# Altium schematic sheet 2_PWR.SchDoc: SmartHalo V1.0 Rev1 - Power Supply
size B; Author: Sébastien Gélinas; Organization: CycleLabs Solutions Inc.; Address1: 5445 de Gaspé; Address2: Montréal, QC; Address3: Canada; Address4: H2T 3B2; DocumentNumber: 1; Revision: 1; SheetNumber: 2; SheetTotal: 8
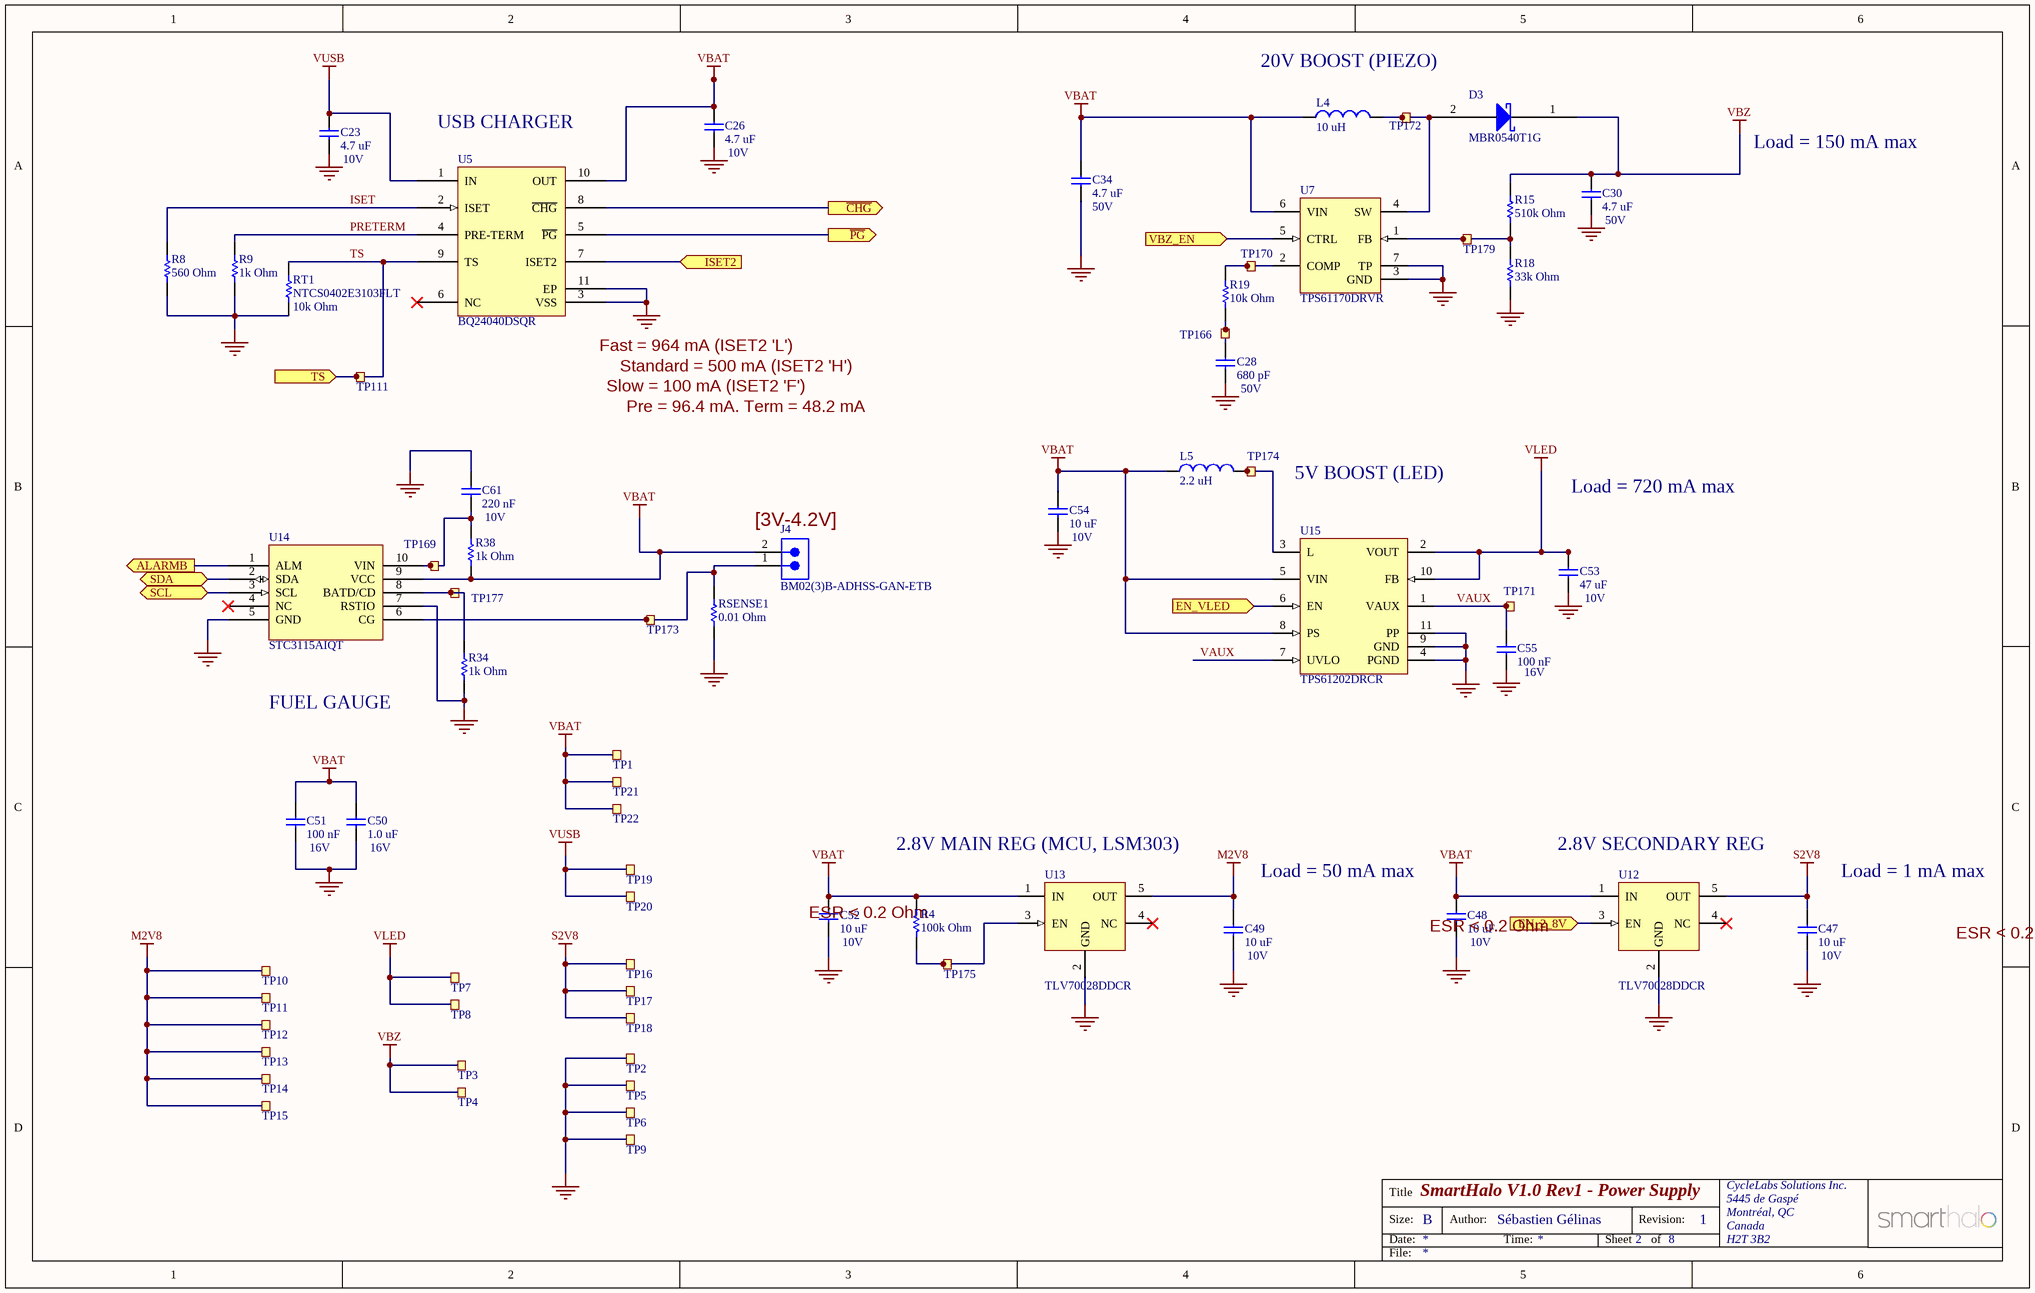
[diagram p0: 2_PWR.SchDoc]

## Parts
C23  4.7 uF  Voltage Rating: 10V  [Varitron_CAP0603]
C26  4.7 uF  Voltage Rating: 10V  [Varitron_CAP0603]
C28  680 pF  Voltage Rating: 50V  [Varitron_CAP0402]
C30  4.7 uF  Voltage Rating: 50V  [Varitron_CAP0805]
C34  4.7 uF  Voltage Rating: 50V  [Varitron_CAP0805]
C47  10 uF  Voltage Rating: 10V  [Varitron_CAP0805]
C48  10 uF  Voltage Rating: 10V  [Varitron_CAP0805]
C49  10 uF  Voltage Rating: 10V  [Varitron_CAP0805]
C50  1.0 uF  Voltage Rating: 16V  [Varitron_CAP0603]
C51  100 nF  Voltage Rating: 16V  [Varitron_CAP0402]
C52  10 uF  Voltage Rating: 10V  [Varitron_CAP0805]
C53  47 uF  Voltage Rating: 10V  [Varitron_CAP1206]
C54  10 uF  Voltage Rating: 10V  [Varitron_CAP0805]
C55  100 nF  Voltage Rating: 16V  [Varitron_CAP0402]
C61  220 nF  Voltage Rating: 10V  [Varitron_CAP0402]
D3  MBR0540T1G  [ONSC-SOD-123-2-425-04_V]
J4  BM02(3)B-ADHSS-GAN-ETB  [BM02(3)B-ADHSS-GAN-ETB]
L4  10 uH  [SRN5020-100M]
L5  2.2 uH  [SRN3015-2R2M]
R4  100k Ohm  [Varitron_RES0402]
R8  560 Ohm  [Varitron_RES0402]
R9  1k Ohm  [Varitron_RES0402]
R15  510k Ohm  [Varitron_RES0402]
R18  33k Ohm  [Varitron_RES0402]
R19  10k Ohm  [Varitron_RES0402]
R34  1k Ohm  [Varitron_RES0402]
R38  1k Ohm  [Varitron_RES0402]
RSENSE1  0.01 Ohm  [Varitron_RES0805]
RT1  NTCS0402E3103FLT  value 10k Ohm  [Varitron_RES0402]
TP1  TP1  [TESTPAD-TH-35mils]  (value not drawn)  (no BOM)
TP2  TP2  [TESTPAD-TH-1_5mm]  (value not drawn)  (no BOM)
TP3  TP3  [TESTPAD-TH-1_5mm]  (value not drawn)  (no BOM)
TP4  TP4  [TESTPAD-TH-35mils]  (value not drawn)  (no BOM)
TP5  TP5  [TESTPAD-TH-1_5mm]  (value not drawn)  (no BOM)
TP6  TP6  [TESTPAD-TH-1_5mm]  (value not drawn)  (no BOM)
TP7  TP7  [TESTPAD-TH-1_5mm]  (value not drawn)  (no BOM)
TP8  TP8  [TESTPAD-TH-1_5mm]  (value not drawn)  (no BOM)
TP9  TP9  [TESTPAD-TH-1_5mm]  (value not drawn)  (no BOM)
TP10  TP10  [TESTPAD-TH-1_5mm]  (value not drawn)  (no BOM)
TP11  TP11  [TESTPAD-TH-1_5mm]  (value not drawn)  (no BOM)
TP12  TP12  [TESTPAD-TH-35mils]  (value not drawn)  (no BOM)
TP13  TP13  [TESTPAD-TH-35mils]  (value not drawn)  (no BOM)
TP14  TP14  [TESTPAD-TH-35mils]  (value not drawn)  (no BOM)
TP15  TP15  [TESTPAD-TH-35mils]  (value not drawn)  (no BOM)
TP16  TP16  [TESTPAD-TH-1_5mm]  (value not drawn)  (no BOM)
TP17  TP17  [TESTPAD-TH-35mils]  (value not drawn)  (no BOM)
TP18  TP18  [TESTPAD-TH-1_5mm]  (value not drawn)  (no BOM)
TP19  TP19  [TESTPAD-TH-1_5mm]  (value not drawn)  (no BOM)
TP20  TP20  [TESTPAD-TH-35mils]  (value not drawn)  (no BOM)
TP21  TP21  [TESTPAD-TH-1_5mm]  (value not drawn)  (no BOM)
TP22  TP22  [TESTPAD-TH-35mils]  (value not drawn)  (no BOM)
TP111  TP111  [TESTPAD-TH-35mils]  (value not drawn)  (no BOM)
TP166  TP166  [TESTPAD-TH-35mils]  (value not drawn)  (no BOM)
TP169  TP169  [TESTPAD-TH-35mils]  (value not drawn)  (no BOM)
TP170  TP170  [TESTPAD-TH-35mils]  (value not drawn)  (no BOM)
TP171  TP171  [TESTPAD-TH-35mils]  (value not drawn)  (no BOM)
TP172  TP172  [TESTPAD-TH-35mils]  (value not drawn)  (no BOM)
TP173  TP173  [TESTPAD-TH-35mils]  (value not drawn)  (no BOM)
TP174  TP174  [TESTPAD-TH-35mils]  (value not drawn)  (no BOM)
TP175  TP175  [TESTPAD-TH-35mils]  (value not drawn)  (no BOM)
TP177  TP177  [TESTPAD-TH-35mils]  (value not drawn)  (no BOM)
TP179  TP179  [TESTPAD-TH-35mils]  (value not drawn)  (no BOM)
U5  BQ24040DSQR  [DSQ10-1500X900TP]
U7  TPS61170DRVR  [DRV6-1600X1000TP]
U12  TLV70028DDCR  [SOT23-5_N]
U13  TLV70028DDCR  [SOT23-5_N]
U14  STC3115AIQT  [DFN10]
U15  TPS61202DRCR  [DRC10-2400X1650TP]

## Ports
ALARMB (out), EN_2_8V (in), EN_VLED (in), ISET2 (in), SCL (bidir), SDA (bidir), TS (in), VBZ_EN (in), ~{CHG} (out), ~{PG} (out)

## Nets
GND: C23.2 C26.2 C28.2 C30.2 C34.2 C47.2 C48.2 C49.2 C50.2 C51.2 C52.2 C53.2 C54.2 C55.2 C61.2 J4.0(ASSY) R8.2 R9.2 R18.1 R34.1 RSENSE1.1 RT1.1 TP2.1 TP5.1 TP6.1 TP9.1 U5.3(VSS) U5.11(EP) U7.3(GND) U7.7(TP) U12.2(GND) U13.2(GND) U14.5(GND) U14.7(RSTIO) U15.4(PGND) U15.9(GND) U15.11(PP)
M2V8: C49.1 TP10.1 TP11.1 TP12.1 TP13.1 TP14.1 TP15.1 U13.5(OUT)
S2V8: C47.1 TP16.1 TP17.1 TP18.1 U12.5(OUT)
VBAT: C26.1 C34.1 C48.1 C50.1 C51.1 C52.1 C54.1 J4.2 L4.1 L5.1 R4.2 R38.1 TP1.1 TP21.1 TP22.1 U5.10(OUT) U7.6(VIN) U12.1(IN) U13.1(IN) U14.9(VCC) U15.5(VIN) U15.8(PS)
VBZ: C30.1 D3.1(Cathode) R15.2 TP3.1 TP4.1
VLED: C53.1 TP7.1 TP8.1 U15.2(VOUT) U15.10(FB)
VUSB: C23.1 TP19.1 TP20.1 U5.1(IN)
ALARMB: U14.1(ALM) ; port ALARMB
~{CHG}: U5.8(~{CHG}) ; port ~{CHG}
EN_2_8V: U12.3(EN) ; port EN_2_8V
EN_VLED: U15.6(EN) ; port EN_VLED
ISET: R8.1 U5.2(ISET)
ISET2: U5.7(ISET2) ; port ISET2
~{PG}: U5.5(~{PG}) ; port ~{PG}
PRETERM: R9.1 U5.4(PRE-TERM)
SCL: U14.3(SCL) ; port SCL
SDA: U14.2(SDA) ; port SDA
TS: RT1.2 TP111.1 U5.9(TS) ; port TS
VAUX: C55.1 TP171.1 U15.1(VAUX) U15.7(UVLO)
VBZ_EN: U7.5(CTRL) ; port VBZ_EN
NetC28_1: C28.1 R19.2 TP166.1
NetC61_1: C61.1 R38.2 TP169.1 U14.10(VIN)
NetD3_2: D3.2(Anode) L4.2 TP172.1 U7.4(SW)
NetJ4_1: J4.1 RSENSE1.2 TP173.1 U14.6(CG)
NetL5_2: L5.2 TP174.1 U15.3(L)
NetR4_1: R4.1 TP175.1 U13.3(EN)
NetR15_1: R15.1 R18.2 TP179.1 U7.1(FB)
NetR19_1: R19.1 TP170.1 U7.2(COMP)
NetR34_2: R34.2 TP177.1 U14.8(BATD/CD)

Not connected (* = marked no-connect by the designer): U5 6(NC)*; U12 4(NC)*; U13 4(NC)*; U14 4(NC)*

## Notes on the sheet
- 20V BOOST (PIEZO)
- (near U5) USB CHARGER
- Load = 150 mA max
- Fast = 964 mA (ISET2 'L')
- (near TP111) Standard = 500 mA (ISET2 'H')
- (near TP111) Slow = 100 mA (ISET2 'F')
- (near TP111) Pre = 96.4 mA. Term = 48.2 mA
- 5V BOOST (LED)
- Load = 720 mA max
- (near J4) [3V-4.2V]
- FUEL GAUGE
- 2.8V MAIN REG (MCU, LSM303)
- Load = 50 mA max
- (near U12) 2.8V SECONDARY REG
- Load = 1 mA max
- (near C52) ESR < 0.2 Ohm
- (near C48) ESR < 0.2 Ohm
- (near C47) ESR < 0.2 Ohm
- Title
- Size:
- Date:
- B
- Author:
- Time:
- Sheet
- Revision:
- of
- File:

## Library data of the parts
C23 C26 = Varitron_CAP0603: 4.7 uF 10V X5R 10% 0603 (1608 Metric)  SMD; Manufacturer: Yageo; Manufacturer Part Number: CC0603KRX5R6BB475; SmartHalo Part Number: 630009-01; Case-EIA: 0603; Case-Metric: 1608; Final: Y; Tolerance: 10%; Technology: SMT; Temperature Coefficient: X5R; Part Number: CC0603KRX5R6BB475; Value: 4.7 uF; Supplier: Arrow Electronics; Footprint Name: 0603
C28 = Varitron_CAP0402: 680 pF 50V X7R 5% 0402 (1005 Metric)  SMD; Manufacturer: Yageo; Manufacturer Part Number: CC0402JRX7R9BB681; SmartHalo Part Number: 630011-01; Case-EIA: 0402; Case-Metric: 1005; Final: Y; Tolerance: 5%; Technology: SMT; Temperature Coefficient: X7R; Part Number: CC0402JRX7R9BB681; Value: 680 pF; Supplier: Arrow Electronics; Footprint Name: 0402
C30 C34 = Varitron_CAP0805: 4.7 uF 50V X5R 10% 0805 (2012 Metric)  SMD; Manufacturer: Samsung; Manufacturer Part Number: CL21A475KBQNNNE; SmartHalo Part Number: 630010-01; Case-EIA: 0805; Case-Metric: 2012; Final: Y; Tolerance: 10%; Technology: SMT; Temperature Coefficient: X5R; Part Number: CL21A475KBQNNNE; Value: 4.7 uF; Supplier: Arrow Electronics; Footprint Name: 0805
C47-C49 C52 C54 = Varitron_CAP0805: 10 uF 10V X7R 10% 0805 (2012 Metric)  SMD; Manufacturer: Samsung; Manufacturer Part Number: CL21B106KPQNNNE; SmartHalo Part Number: 630013-01; Case-EIA: 0805; Case-Metric: 2012; Final: Y; Tolerance: 10%; Technology: SMT; Temperature Coefficient: X7R; Part Number: CL21B106KPQNNNE; Value: 10 uF; Supplier: Arrow Electronics; Footprint Name: 0805
C50 = Varitron_CAP0603: 1.0 uF 16V X7R 10% 0603 (1608 Metric)  SMD; Manufacturer: Samsung; Manufacturer Part Number: CL10B105KO8NNNC; SmartHalo Part Number: 630002-01; Case-EIA: 0603; Case-Metric: 1608; Final: Y; Tolerance: 10%; Technology: SMT; Temperature Coefficient: X7R; Part Number: CL10B105KO8NNNC; Value: 1.0 uF; Supplier: Arrow Electronics; Footprint Name: 0603
C51 C55 = Varitron_CAP0402: 100 nF 16V X7R 10% 0402 (1005 Metric)  SMD; Manufacturer: Samsung; Manufacturer Part Number: CL05B104KO5NNNC; SmartHalo Part Number: 630003-01; Case-EIA: 0402; Case-Metric: 1005; Final: Y; Tolerance: 10%; Technology: SMT; Temperature Coefficient: X7R; Part Number: CL05B104KO5NNNC; Value: 100 nF; Supplier: Arrow Electronics; Footprint Name: 0402
C53 = Varitron_CAP1206: 47 uF 10V X5R 10% 1206 (3216 Metric)  SMD; Manufacturer: Murata; Manufacturer Part Number: GRM31CR61A476KE15L; SmartHalo Part Number: 630015-01; Case-EIA: 1206; Case-Metric: 3216; Final: Y; Tolerance: 10%; Technology: SMT; Temperature Coefficient: X5R; Part Number: GRM31CR61A476KE15L; Value: 47 uF; Supplier: Arrow Electronics; Footprint Name: 1206
C61 = Varitron_CAP0402: 220 nF 10V X7R 10% 0402 (1005 Metric)  SMD; Manufacturer: Samsung; Manufacturer Part Number: CL05B224KP5NNNC; SmartHalo Part Number: 630014-01; Case-EIA: 0402; Case-Metric: 1005; Final: Y; Tolerance: 10%; Technology: SMT; Temperature Coefficient: X7R; Part Number: CL05B224KP5NNNC; Value: 220 nF; Supplier: Arrow Electronics; Footprint Name: 0402
D3 = MBR0540T1G: Schottky Power Rectifier, 2-Pin SOD-123, Pb-Free, Tape and Reel; Manufacturer: ON Semiconductor; SmartHalo Part Number: 630017-01; Final: Y; Manufacturer Part Number: MBR0540T1G; Part Number: MBR0540T1G; Footprint Name: SOD123; Supplier: Arrow Electronics
J4 = BM02(3)B-ADHSS-GAN-ETB: Connector, 1.3 mm pitch; Manufacturer: JST; SmartHalo Part Number: 630021-01; Final: Y; Manufacturer Part Number: BM02(3)B-ADHSS-GAN-ETB; Part Number: BM02(3)B-ADHSS-GAN-ETB; Footprint Name: CUSTOM(ADH Connector 2 pins); Supplier: Arrow Electronics
L4 = SRN5020-100M: Inductor, 10 uH, 20%, 144 mOhm DCR, 1.3A; Manufacturer: Bourns; SmartHalo Part Number: 630027-01; Final: Y; Manufacturer Part Number: SRN5020-100M; Part Number: SRN5020-100M; Value: 10 uH; Tolerance: 20%; DCR: 144 mOhm; Saturation Current: 1.3A; Footprint Name: IND5020; Supplier: Arrow Electronics
L5 = SRN3015-2R2M: Inductor, 2.2 uH, 20%, 72 mOhm DCR, 1.65A; Manufacturer: Bourns; SmartHalo Part Number: 630028-01; DCR: 72 mOhm; Final: Y; Manufacturer Part Number: SRN3015-2R2M; Part Number: SRN3015-2R2M; Value: 2.2 uH; Tolerance: 20%; Saturation Current: 1.65A; Footprint Name: IND3015; Supplier: Arrow Electronics
R4 = Varitron_RES0402: 100k 0.063W 5%  0402 (1005 Metric)  SMD; Manufacturer: Samsung; Manufacturer Part Number: RC1005J104CS; SmartHalo Part Number: 630036-01; Case-Metric: 1005; Case-EIA: 0402; Final: Y; Tolerance: 5%; Technology: SMT; Power: 0.063W; Part Number: RC1005J104CS; Value: 100k Ohm; Footprint Name: 0402; Supplier: Arrow Electronics
R8 = Varitron_RES0402: 560R 0.063W 5%  0402 (1005 Metric)  SMD; Manufacturer: Samsung; Manufacturer Part Number: RC1005J561CS; SmartHalo Part Number: 630039-01; Case-Metric: 1005; Case-EIA: 0402; Final: Y; Tolerance: 5%; Technology: SMT; Power: 0.063W; Part Number: RC1005J561CS; Value: 560 Ohm; Footprint Name: 0402; Supplier: Arrow Electronics
R9 R34 R38 = Varitron_RES0402: 1k 0.063W 5%  0402 (1005 Metric)  SMD; Manufacturer: Samsung; Manufacturer Part Number: RC1005J102CS; SmartHalo Part Number: 630040-01; Case-Metric: 1005; Case-EIA: 0402; Final: Y; Tolerance: 5%; Technology: SMT; Power: 0.063W; Part Number: RC1005J102CS; Value: 1k Ohm; Footprint Name: 0402; Supplier: Arrow Electronics
R15 = Varitron_RES0402: 510k 0.063W 5%  0402 (1005 Metric)  SMD; Manufacturer: Samsung; Manufacturer Part Number: RC1005J514CS; SmartHalo Part Number: 630043-01; Case-Metric: 1005; Case-EIA: 0402; Final: Y; Tolerance: 5%; Technology: SMT; Power: 0.063W; Part Number: RC1005J514CS; Value: 510k Ohm; Footprint Name: 0402; Supplier: Arrow Electronics
R18 = Varitron_RES0402: 33k 0.063W 5%  0402 (1005 Metric)  SMD; Manufacturer: Samsung; Manufacturer Part Number: RC1005J333CS; SmartHalo Part Number: 630045-01; Case-Metric: 1005; Case-EIA: 0402; Final: Y; Tolerance: 5%; Technology: SMT; Power: 0.063W; Part Number: RC1005J333CS; Value: 33k Ohm; Footprint Name: 0402; Supplier: Arrow Electronics
R19 = Varitron_RES0402: 10k 0.063W 5%  0402 (1005 Metric)  SMD; Manufacturer: Samsung; Manufacturer Part Number: RC1005J103CS; SmartHalo Part Number: 630041-01; Case-Metric: 1005; Case-EIA: 0402; Final: Y; Tolerance: 5%; Technology: SMT; Power: 0.063W; Part Number: RC1005J103CS; Value: 10k Ohm; Footprint Name: 0402; Supplier: Arrow Electronics
RSENSE1 = Varitron_RES0805: 0R01 0.25W 1%  0805 (2012 Metric)  SMD; Manufacturer: TT Electronics; Manufacturer Part Number: LRMAM0805-R01FT4; SmartHalo Part Number: 630049-01; 2nd Manufacturer Part Number: WSL0805R0100FEA18; 2nd Manufacturer: Vishay; Case-Metric: 2012; Case-EIA: 0805; Final: Y; Tolerance: 1%; Technology: SMT; Power: 0.25W; Part Number: LRMAM0805-R01FT4; Value: 0.01 Ohm; Footprint Name: 0805; Supplier: Arrow Electronics
RT1 = NTCS0402E3103FLT: Thermistor NTC 0402, R0 10k, 1%, B 3490, SMD; Manufacturer: Vishay; SmartHalo Part Number: 630050-01; Case-Metric: 1005; Case-EIA: 0402; Beta: 3490; Final: Y; Tolerance: 1%; Technology: SMT; Part Number: NTCS0402E3103FLT; Manufacturer Part Number: NTCS0402E3103FLT; Footprint Name: 0402; Supplier: Arrow Electronics
TP1 TP4 TP12-TP15 TP17 TP20 TP22 TP111 TP166 TP169-TP175 TP177 TP179 = TESTPAD_TH_35mils: Testpoint, through hole, 35 mils; Value: TP
TP2 TP3 TP5-TP11 TP16 TP18 TP19 TP21 = TESTPAD_TH_1_5MM: Testpoint, through hole, 1.5mm; Value: TP
U5 = BQ24040DSQR: 800 mA, Single-Input, Single Cell Li-Ion Battery Charger with Auto Start. Vovp=6.6 V, 3.5 V, -40 to 85 degC, 10-pin SON (DSQ), Green (RoHS & no Sb/Br); Manufacturer: Texas Instruments; SmartHalo Part Number: 630055-01; Final: Y; Manufacturer Part Number: BQ24040DSQR; Part Number: BQ24040DSQR; Footprint Name: WSON10; Supplier: Arrow Electronics
U7 = TPS61170DRVR: Boost Voltage Converter with 3 to 18 V Input and 3 to 38 V Output, -40 to 85 degC, 6-Pin SON (DRC), Green (RoHS & no Sb/Br); Manufacturer: Texas Instruments; SmartHalo Part Number: 630056-01; Final: Y; Part Number: TPS61170DRVR; Manufacturer Part Number: TPS61170DRVR; Footprint Name: SON6; Supplier: Arrow Electronics
U12 U13 = TLV70028DDCR: 200 mA Low Dropout Regulator, 2 - 5.5V Input, Fixed 2.8V Output; Manufacturer: Texas Instruments; SmartHalo Part Number: 630060-01; Final: Y; Part Number: TLV70028DDCR; Manufacturer Part Number: TLV70028DDCR; Footprint Name: SOT23-5; Supplier: Arrow Electronics
U14 = STC3115AIQT: IC Battery Fuel Gauge for 1-Cell Lithium-ion (Li+); Manufacturer: ST Microelectronics; SmartHalo Part Number: 630061-01; Final: Y; Manufacturer Part Number: STC3115AIQT; Part Number: STC3115AIQT; Footprint Name: DFN10; Supplier: Arrow Electronics
U15 = TPS61202DRCR: Boost Voltage Converter with 0.3 to 5.5 V Input and 5 V Output, -40 to 85 degC, 10-Pin SON (DRC), Green (RoHS & no Sb/Br); Manufacturer: Texas Instruments; SmartHalo Part Number: 630062-01; Final: Y; Part Number: TPS61202DRCR; Manufacturer Part Number: TPS61202DRCR; Footprint Name: SON10; Supplier: Arrow Electronics